# Altium schematic sheet Main.SchDoc
size A4; PageSetup: Record=PageOptions|CenterHorizontal=True|CenterVertical=True|PrintScale=0.97|XCorrection=1.00|YCorrection=1.00|PrintKind=1|BorderSize=5000000|LeftOffset=0|BottomOffset=0|Orientation=2|PaperLength=2970|PaperWidth=2100|Scale=100|PaperSource=7|PrintQuality=1200|MediaType=1|DitherType=10|PrintScaleMode=1|PaperKind=A4|PaperIndex=9
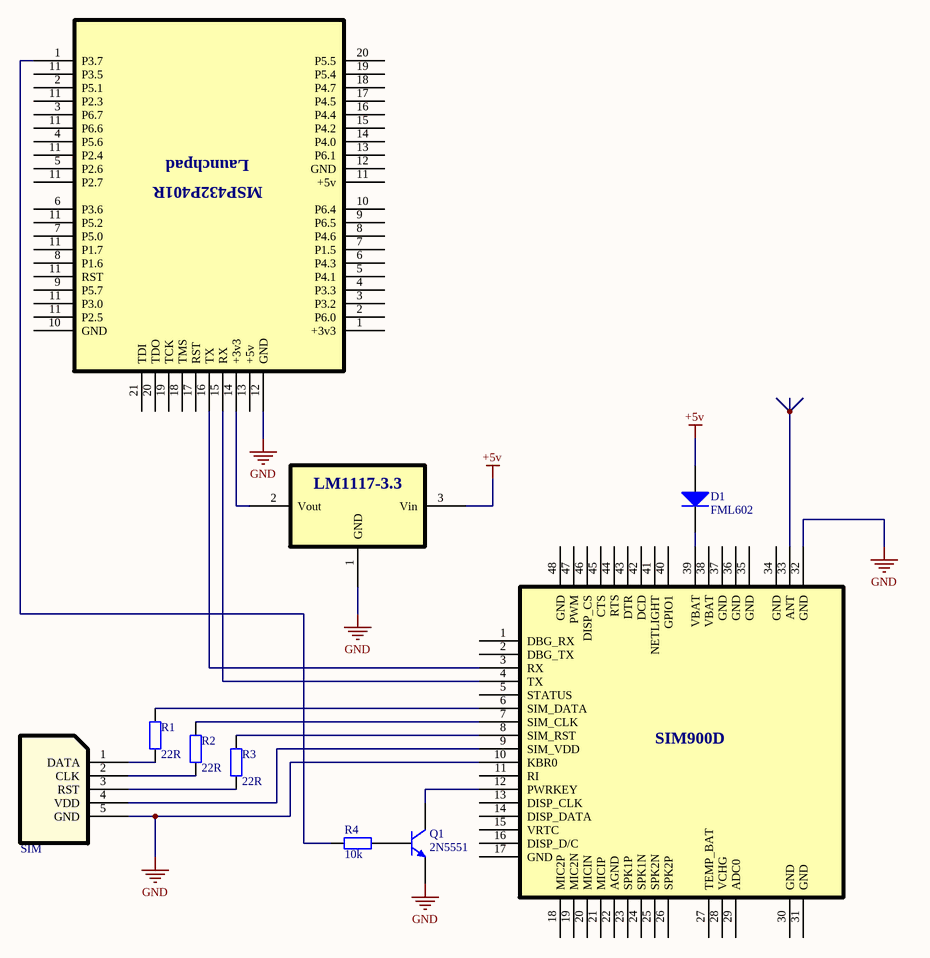
[diagram p0: Main.SchDoc]

## Parts
(Parts that share a designator on the sheet are numbered #1, #2 ... from top to bottom, then left to right.)
*#1  MSP432P401RLaunchpad  (value not drawn)
*#2  LM1117-3.3  (value not drawn)
*#3  SIM  (value not drawn)
*#4  SIM900D  (value not drawn)
D1  FML602  [SMC]
Q1  2N5551  [TO-92A]
R1  value 22R  [AXIAL-0.4]  (hidden comment: Res2)
R2  value 22R  [AXIAL-0.4]  (hidden comment: Res2)
R3  value 22R  [AXIAL-0.4]  (hidden comment: Res2)
R4  value 10k  [AXIAL-0.4]  (hidden comment: Res2)

## Nets
+5v: *#2.3(Vin) D1.1(A)
GND: *#1.12(GND) *#2.1(GND) *#3.5(GND) *#4.10(KBR0) *#4.32(GND) Q1.1(E)
Net*#1_1: *#1.1(+3v3) R4.2
Net*#1_14: *#1.14(P4.0) *#2.2(Vout)
Net*#1_15: *#1.15(P4.2) *#4.4(TX)
Net*#1_16: *#1.16(P4.4) *#4.3(RX)
Net*#3_1: *#3.1(DATA) R1.1
Net*#3_2: *#3.2(CLK) R2.1
Net*#3_3: *#3.3(RST) R3.1
Net*#3_4: *#3.4(VDD) *#4.9(SIM_VDD)
Net*#4_6: *#4.6(SIM_DATA) R1.2
Net*#4_7: *#4.7(SIM_CLK) R2.2
Net*#4_8: *#4.8(SIM_RST) R3.2
Net*#4_12: *#4.12(PWRKEY) Q1.3(C)
Net*#4_39: *#4.39(VBAT) D1.2(K)
NetQ1_2: Q1.2(B) R4.1

Not connected (* = marked no-connect by the designer): *#1 2(P6.0) 3(P3.2) 4(P3.3) 5(P4.1) 6(P4.3) 7(P1.5) 8(P4.6) 9(P6.5) 10(P6.4) 11(+5v) 13(P6.1) 17(P4.5) 18(P4.7) 19(P5.4) 20(P5.5) 21(TDI); *#4 1(DBG_RX) 2(DBG_TX) 5(STATUS) 11(RI) 13(DISP_CLK) 14(DISP_DATA) 15(VRTC) 16(DISP_D/C) 17(GND) 18(MIC2P) 19(MIC2N) 20(MICIN) 21(MICIP) 22(AGND) 23(SPK1P) 24(SPK1N) 25(SPK2N) 26(SPK2P) 27(TEMP_BAT) 28(VCHG) 29(ADC0) 30(GND) 31(GND) 33(ANT) 34(GND) 35(GND) 36(GND) 37(GND) 38(VBAT) 40(GPIO1) 41(NETLIGHT) 42(DCD) 43(DTR) 44(RTS) 45(CTS) 46(DISP_CS) 47(PWM) 48(GND)

## Notes on the sheet
- SIM
- (in symbol MSP432P401RLaunchpad) Launchpad; MSP432P401R

## Library data of the parts
D1 = Diode: Published: 8-Jun-2000; LatestRevisionDate: 17-Jul-2002; LatestRevisionNote: Re-released for DXP Platform.; PackageVersion: Sep-1996; PackageReference: SMC; Publisher: Altium Limited; PackageDescription: DO-214-AB/SMC; 2 C-Bend Leads; Body 7.9 x 5.9 mm, inc. leads (LxW); Code_JEDEC: DO-214-AB
Q1 = 2N3904: NPN General Purpose Amplifier; Published: 8-Jun-2000; LatestRevisionDate: 15-Jan-2003; LatestRevisionNote: PCB Footprint 'BCY-W3/D4.7' replaced; DatasheetVersion: 1997; PackageVersion: Sep-1998; PackageReference: TO-92A; Publisher: Altium Limited; PackageDescription: TO, Flat Index; 3 In-Line, Axial Leads; Body Dia. 4.5mm; Leads 0.51 x 0.48 mm (max); ComponentLink1Description: Manufacturer Link; ComponentLink1URL: http://www.fairchildsemi.com/; ComponentLink2Description: Datasheet; ComponentLink2URL: http://www.fairchildsemi.com/ds/2N%2F2N3904.pdf
R1-R4 = Res2: Resistor; Published: 8-Jun-2000; LatestRevisionDate: 17-Jul-2002; LatestRevisionNote: Re-released for DXP Platform.; PackageReference: AXIAL-0.4; Publisher: Altium Limited; PackageDescription: Axial Device, Thru-Hole; 2 Leads; 0.4 in Pin Spacing